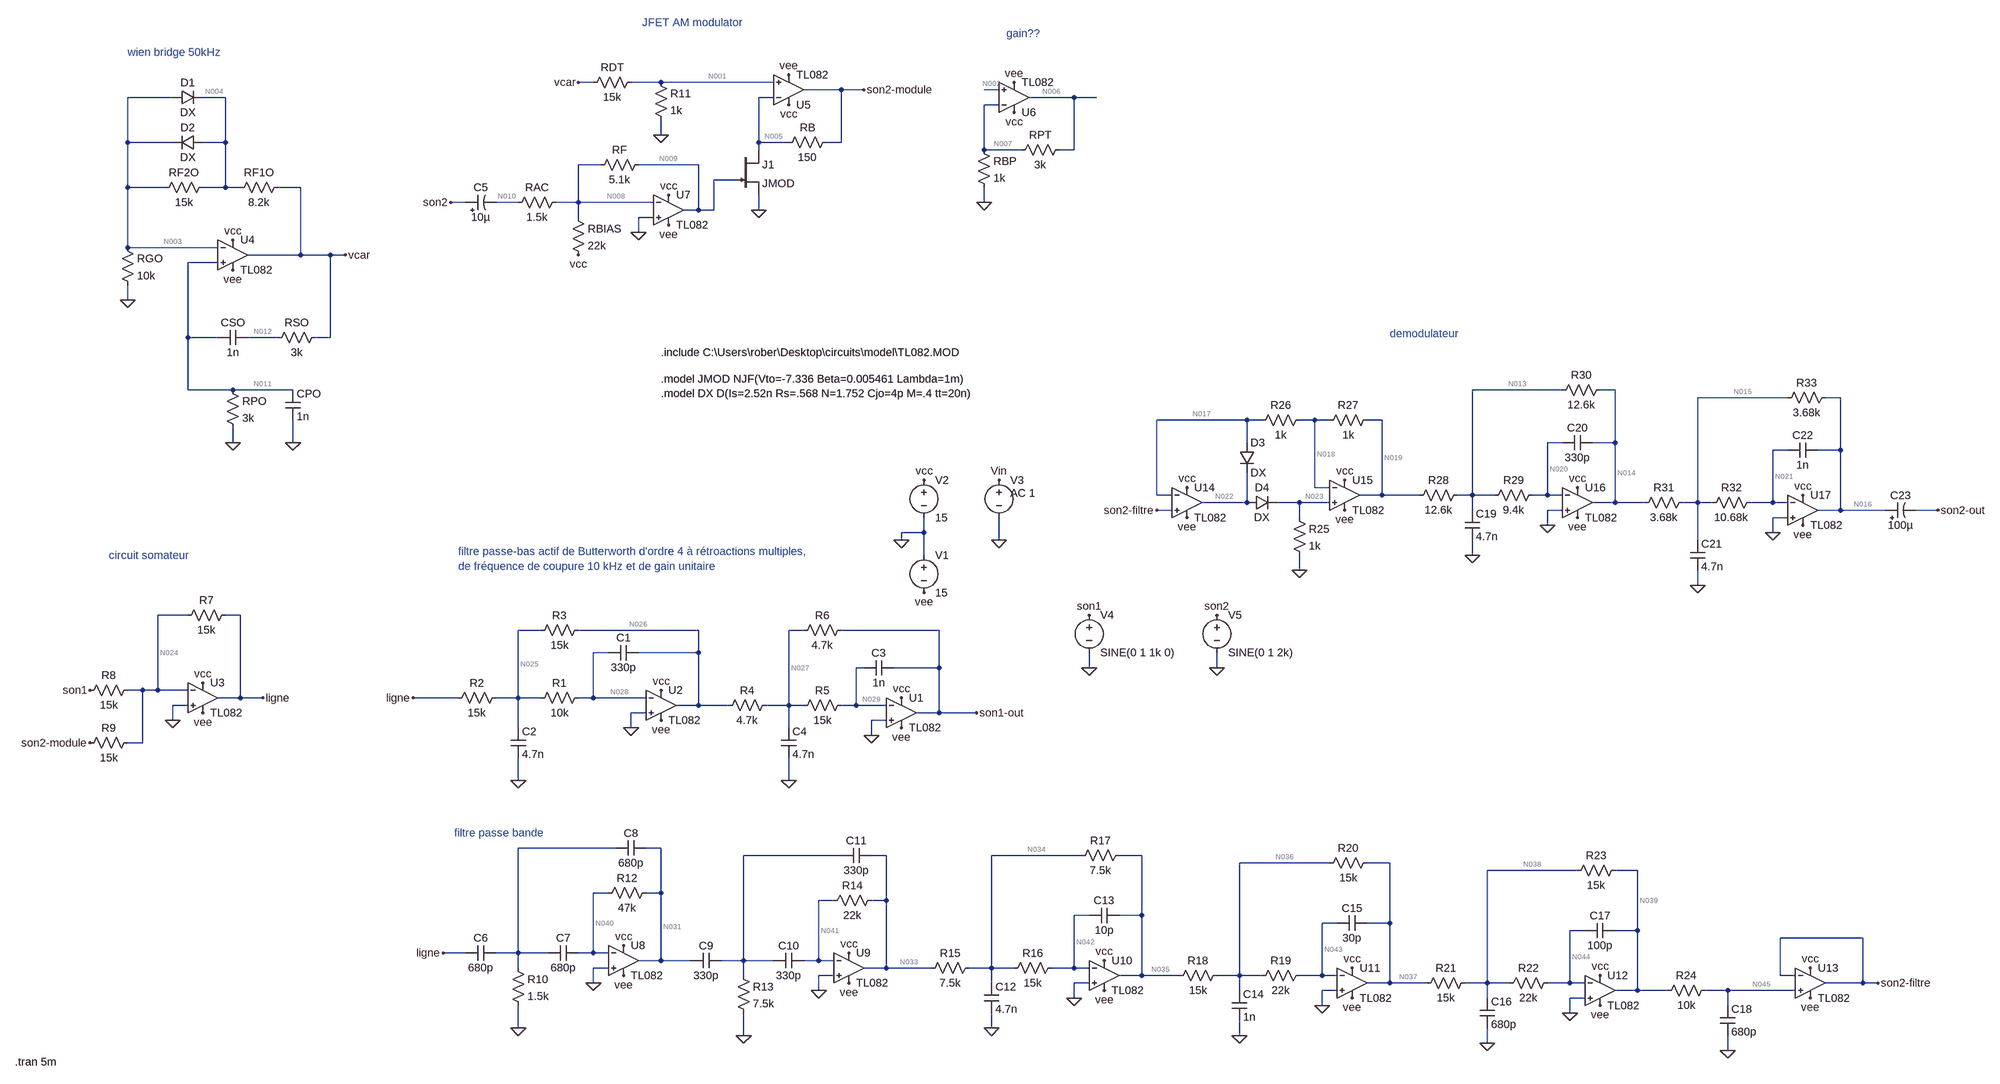
[diagram p0: schematic total.asc]
total.asc, the LTspice schematic file:
Version 4.1
SHEET 1 2896 856
WIRE -192 -1248 -224 -1248
WIRE -48 -1248 -112 -1248
WIRE 192 -1248 -48 -1248
WIRE 336 -1232 256 -1232
WIRE 384 -1232 336 -1232
WIRE 672 -1232 640 -1232
WIRE -1088 -1216 -1184 -1216
WIRE -976 -1216 -1024 -1216
WIRE 192 -1216 160 -1216
WIRE 832 -1216 736 -1216
WIRE 880 -1216 832 -1216
WIRE 672 -1200 640 -1200
WIRE -48 -1136 -48 -1168
WIRE -1184 -1120 -1184 -1216
WIRE -1088 -1120 -1184 -1120
WIRE -976 -1120 -976 -1216
WIRE -976 -1120 -1024 -1120
WIRE 160 -1120 160 -1216
WIRE 224 -1120 160 -1120
WIRE 336 -1120 336 -1232
WIRE 336 -1120 304 -1120
WIRE 160 -1104 160 -1120
WIRE 640 -1104 640 -1200
WIRE 720 -1104 640 -1104
WIRE 832 -1104 832 -1216
WIRE 832 -1104 800 -1104
WIRE -176 -1072 -224 -1072
WIRE 32 -1072 -96 -1072
WIRE 112 -1040 64 -1040
WIRE -1184 -1024 -1184 -1120
WIRE -1104 -1024 -1184 -1024
WIRE -976 -1024 -976 -1120
WIRE -976 -1024 -1024 -1024
WIRE -944 -1024 -976 -1024
WIRE -816 -1024 -864 -1024
WIRE -464 -992 -496 -992
WIRE -352 -992 -400 -992
WIRE -224 -992 -224 -1072
WIRE -224 -992 -272 -992
WIRE -64 -992 -224 -992
WIRE 640 -992 640 -1024
WIRE 32 -976 32 -1072
WIRE 32 -976 0 -976
WIRE 64 -976 64 -1040
WIRE 64 -976 32 -976
WIRE 160 -976 160 -1008
WIRE -224 -960 -224 -992
WIRE -64 -960 -96 -960
WIRE -96 -928 -96 -960
WIRE -1184 -896 -1184 -1024
WIRE -992 -896 -1184 -896
WIRE -816 -880 -816 -1024
WIRE -816 -880 -928 -880
WIRE -752 -880 -816 -880
WIRE -720 -880 -752 -880
WIRE -992 -864 -1056 -864
WIRE -1184 -784 -1184 -816
WIRE -1056 -704 -1056 -864
WIRE -992 -704 -1056 -704
WIRE -864 -704 -928 -704
WIRE -752 -704 -752 -880
WIRE -752 -704 -784 -704
WIRE -1056 -592 -1056 -704
WIRE -960 -592 -1056 -592
WIRE -832 -592 -960 -592
WIRE 1872 -592 1680 -592
WIRE 1984 -592 1952 -592
WIRE 2352 -576 2160 -576
WIRE 2464 -576 2432 -576
WIRE 1200 -528 1008 -528
WIRE 1232 -528 1200 -528
WIRE 1344 -528 1312 -528
WIRE 1376 -528 1344 -528
WIRE 1488 -528 1456 -528
WIRE -960 -480 -960 -512
WIRE -832 -480 -832 -528
WIRE 1200 -480 1200 -528
WIRE 1872 -480 1840 -480
WIRE 1984 -480 1984 -592
WIRE 1984 -480 1936 -480
WIRE 2352 -464 2320 -464
WIRE 2464 -464 2464 -576
WIRE 2464 -464 2416 -464
WIRE 1344 -384 1344 -528
WIRE 1376 -384 1344 -384
WIRE 1008 -368 1008 -528
WIRE 1040 -368 1008 -368
WIRE 1488 -368 1488 -528
WIRE 1488 -368 1440 -368
WIRE 1568 -368 1488 -368
WIRE 1680 -368 1680 -592
WIRE 1680 -368 1648 -368
WIRE 1728 -368 1680 -368
WIRE 1840 -368 1840 -480
WIRE 1840 -368 1808 -368
WIRE 1872 -368 1840 -368
WIRE 1200 -352 1200 -416
WIRE 1200 -352 1104 -352
WIRE 1312 -352 1264 -352
WIRE 1376 -352 1312 -352
WIRE 1984 -352 1984 -480
WIRE 1984 -352 1936 -352
WIRE 2048 -352 1984 -352
WIRE 2160 -352 2160 -576
WIRE 2160 -352 2128 -352
WIRE 2192 -352 2160 -352
WIRE 2320 -352 2320 -464
WIRE 2320 -352 2272 -352
WIRE 2352 -352 2320 -352
WIRE 1040 -336 1008 -336
WIRE 1680 -336 1680 -368
WIRE 1872 -336 1840 -336
WIRE 2464 -336 2464 -464
WIRE 2464 -336 2416 -336
WIRE 2560 -336 2464 -336
WIRE 2672 -336 2624 -336
WIRE 1312 -320 1312 -352
WIRE 2352 -320 2320 -320
WIRE 1840 -304 1840 -336
WIRE 512 -288 512 -320
WIRE 512 -288 464 -288
WIRE 2320 -288 2320 -320
WIRE 464 -272 464 -288
WIRE 672 -272 672 -320
WIRE 2160 -272 2160 -352
WIRE 512 -240 512 -288
WIRE 1680 -240 1680 -272
WIRE 1312 -208 1312 -240
WIRE 2160 -176 2160 -208
WIRE -1056 -112 -1120 -112
WIRE -944 -112 -976 -112
WIRE -304 -80 -352 -80
WIRE 32 -80 -224 -80
WIRE 256 -80 224 -80
WIRE 544 -80 336 -80
WIRE -160 -32 -192 -32
WIRE 32 -32 32 -80
WIRE 32 -32 -96 -32
WIRE 384 0 368 0
WIRE 544 0 544 -80
WIRE 544 0 448 0
WIRE 864 0 864 -32
WIRE 1136 0 1136 -32
WIRE -1152 48 -1184 48
WIRE -1120 48 -1120 -112
WIRE -1120 48 -1152 48
WIRE -1056 48 -1120 48
WIRE -944 64 -944 -112
WIRE -944 64 -992 64
WIRE -896 64 -944 64
WIRE -480 64 -576 64
WIRE -352 64 -352 -80
WIRE -352 64 -400 64
WIRE -304 64 -352 64
WIRE -192 64 -192 -32
WIRE -192 64 -224 64
WIRE -80 64 -192 64
WIRE -1056 80 -1088 80
WIRE 32 80 32 -32
WIRE 32 80 -16 80
WIRE 96 80 32 80
WIRE 224 80 224 -80
WIRE 224 80 176 80
WIRE 256 80 224 80
WIRE 368 80 368 0
WIRE 368 80 336 80
WIRE 432 80 368 80
WIRE -80 96 -112 96
WIRE 544 96 544 0
WIRE 544 96 496 96
WIRE 624 96 544 96
WIRE -1088 112 -1088 80
WIRE 432 112 400 112
WIRE -352 128 -352 64
WIRE -112 128 -112 96
WIRE 224 128 224 80
WIRE 400 144 400 112
WIRE -1152 160 -1152 48
WIRE -1152 160 -1184 160
WIRE -352 240 -352 192
WIRE 224 240 224 192
WIRE -144 384 -352 384
WIRE -48 384 -80 384
WIRE 336 400 128 400
WIRE 432 400 400 400
WIRE 848 400 656 400
WIRE 976 400 928 400
WIRE 1376 416 1184 416
WIRE 1504 416 1456 416
WIRE 1904 432 1712 432
WIRE 2032 432 1984 432
WIRE -160 480 -192 480
WIRE -48 480 -48 384
WIRE -48 480 -80 480
WIRE 320 496 288 496
WIRE 432 496 432 400
WIRE 432 496 400 496
WIRE 864 528 832 528
WIRE 976 528 976 400
WIRE 976 528 928 528
WIRE 1392 544 1360 544
WIRE 1504 544 1504 416
WIRE 1504 544 1456 544
WIRE 1920 560 1888 560
WIRE 2032 560 2032 432
WIRE 2032 560 1984 560
WIRE 2512 576 2336 576
WIRE -464 608 -512 608
WIRE -352 608 -352 384
WIRE -352 608 -400 608
WIRE -288 608 -352 608
WIRE -192 608 -192 480
WIRE -192 608 -224 608
WIRE -160 608 -192 608
WIRE -48 624 -48 480
WIRE -48 624 -96 624
WIRE 16 624 -48 624
WIRE 128 624 128 400
WIRE 128 624 80 624
WIRE 192 624 128 624
WIRE 288 624 288 496
WIRE 288 624 256 624
WIRE 320 624 288 624
WIRE -352 640 -352 608
WIRE -160 640 -192 640
WIRE 432 640 432 496
WIRE 432 640 384 640
WIRE 528 640 432 640
WIRE 656 640 656 400
WIRE 656 640 608 640
WIRE 704 640 656 640
WIRE 832 640 832 528
WIRE 832 640 784 640
WIRE 864 640 832 640
WIRE 128 656 128 624
WIRE 320 656 288 656
WIRE 976 656 976 528
WIRE 976 656 928 656
WIRE 1056 656 976 656
WIRE 1184 656 1184 416
WIRE 1184 656 1136 656
WIRE 1232 656 1184 656
WIRE 1360 656 1360 544
WIRE 1360 656 1312 656
WIRE 1392 656 1360 656
WIRE 2336 656 2336 576
WIRE 2368 656 2336 656
WIRE -192 672 -192 640
WIRE 656 672 656 640
WIRE 864 672 832 672
WIRE 1504 672 1504 544
WIRE 1504 672 1456 672
WIRE 1584 672 1504 672
WIRE 1712 672 1712 432
WIRE 1712 672 1664 672
WIRE 1760 672 1712 672
WIRE 1888 672 1888 560
WIRE 1888 672 1840 672
WIRE 1920 672 1888 672
WIRE 2512 672 2512 576
WIRE 2512 672 2432 672
WIRE 2544 672 2512 672
WIRE 288 688 288 656
WIRE 1184 688 1184 656
WIRE 1392 688 1360 688
WIRE 2032 688 2032 560
WIRE 2032 688 1984 688
WIRE 2096 688 2032 688
WIRE 2224 688 2176 688
WIRE 2368 688 2224 688
WIRE 832 704 832 672
WIRE 1712 704 1712 672
WIRE 1920 704 1888 704
WIRE 1360 720 1360 688
WIRE 2224 720 2224 688
WIRE 1888 736 1888 704
WIRE -352 768 -352 720
WIRE 656 768 656 736
WIRE 128 784 128 736
WIRE 1184 784 1184 752
WIRE 1712 800 1712 768
WIRE 2224 816 2224 784
FLAG 464 -272 0
FLAG 512 -400 vcc
FLAG 464 64 vcc
FLAG 512 -160 vee
FLAG 464 128 vee
FLAG -48 48 vcc
FLAG -48 112 vee
FLAG -112 128 0
FLAG 400 144 0
FLAG -352 240 0
FLAG 224 240 0
FLAG 672 -272 0
FLAG 672 -400 Vin
FLAG -1024 32 vcc
FLAG -1024 96 vee
FLAG -1088 112 0
FLAG -1264 48 son1
FLAG -1264 160 son2-module
FLAG -896 64 ligne
FLAG -576 64 ligne
FLAG -960 -912 vcc
FLAG -960 -848 vee
FLAG -1184 -784 0
FLAG -960 -480 0
FLAG -832 -480 0
FLAG -720 -880 vcar
FLAG -48 -1136 0
FLAG 224 -1200 vcc
FLAG 224 -1264 vee
FLAG 704 -1184 vcc
FLAG 704 -1248 vee
FLAG -32 -1008 vcc
FLAG -32 -944 vee
FLAG 160 -976 0
FLAG -224 -1248 vcar
FLAG 640 -992 0
FLAG 384 -1232 son2-module
FLAG -96 -928 0
FLAG -224 -880 vcc
FLAG -496 -992 son2
FLAG -512 608 ligne
FLAG -352 768 0
FLAG -128 592 vcc
FLAG -128 656 vee
FLAG -192 672 0
FLAG 128 784 0
FLAG 352 608 vcc
FLAG 352 672 vee
FLAG 288 688 0
FLAG 656 768 0
FLAG 896 624 vcc
FLAG 896 688 vee
FLAG 832 704 0
FLAG 1184 784 0
FLAG 1424 640 vcc
FLAG 1424 704 vee
FLAG 1360 720 0
FLAG 1712 800 0
FLAG 1952 656 vcc
FLAG 1952 720 vee
FLAG 1888 736 0
FLAG 2224 816 0
FLAG 2400 640 vcc
FLAG 2400 704 vee
FLAG 1072 -384 vcc
FLAG 1072 -320 vee
FLAG 1408 -400 vcc
FLAG 1408 -336 vee
FLAG 1904 -384 vcc
FLAG 1904 -320 vee
FLAG 1312 -208 0
FLAG 1680 -240 0
FLAG 1840 -304 0
FLAG 2384 -368 vcc
FLAG 2384 -304 vee
FLAG 2160 -176 0
FLAG 2320 -288 0
FLAG 624 96 son1-out
FLAG 2544 672 son2-filtre
FLAG 1008 -336 son2-filtre
FLAG 2672 -336 son2-out
FLAG 864 0 0
FLAG 1136 0 0
FLAG 864 -112 son1
FLAG 1136 -112 son2
SYMBOL OpAmps\\opamp2 464 32 R0
SYMATTR InstName U1
SYMATTR Value TL082
SYMBOL voltage 512 -256 R0
WINDOW 123 0 0 Left 0
WINDOW 39 0 0 Left 0
SYMATTR InstName V1
SYMATTR Value 15
SYMBOL voltage 512 -416 R0
WINDOW 123 0 0 Left 0
WINDOW 39 0 0 Left 0
SYMATTR InstName V2
SYMATTR Value 15
SYMBOL OpAmps\\opamp2 -48 16 R0
SYMATTR InstName U2
SYMATTR Value TL082
SYMBOL res -208 48 R90
WINDOW 0 0 56 VBottom 2
WINDOW 3 32 56 VTop 2
SYMATTR InstName R1
SYMATTR Value 10k
SYMBOL res -384 48 R90
WINDOW 0 0 56 VBottom 2
WINDOW 3 32 56 VTop 2
SYMATTR InstName R2
SYMATTR Value 15k
SYMBOL res -208 -96 R90
WINDOW 0 0 56 VBottom 2
WINDOW 3 32 56 VTop 2
SYMATTR InstName R3
SYMATTR Value 15k
SYMBOL cap -96 -48 R90
WINDOW 0 0 32 VBottom 2
WINDOW 3 32 32 VTop 2
SYMATTR InstName C1
SYMATTR Value 330p
SYMBOL cap -368 128 R0
SYMATTR InstName C2
SYMATTR Value 4.7n
SYMBOL res 192 64 R90
WINDOW 0 0 56 VBottom 2
WINDOW 3 32 56 VTop 2
SYMATTR InstName R4
SYMATTR Value 4.7k
SYMBOL res 352 64 R90
WINDOW 0 0 56 VBottom 2
WINDOW 3 32 56 VTop 2
SYMATTR InstName R5
SYMATTR Value 15k
SYMBOL res 352 -96 R90
WINDOW 0 0 56 VBottom 2
WINDOW 3 32 56 VTop 2
SYMATTR InstName R6
SYMATTR Value 4.7k
SYMBOL cap 448 -16 R90
WINDOW 0 0 32 VBottom 2
WINDOW 3 32 32 VTop 2
SYMATTR InstName C3
SYMATTR Value 1n
SYMBOL cap 208 128 R0
SYMATTR InstName C4
SYMATTR Value 4.7n
SYMBOL voltage 672 -416 R0
WINDOW 123 24 44 Left 2
WINDOW 39 0 0 Left 0
SYMATTR Value2 AC 1
SYMATTR InstName V3
SYMATTR Value ""
SYMBOL OpAmps\\opamp2 -1024 0 R0
SYMATTR InstName U3
SYMATTR Value TL082
SYMBOL res -960 -128 R90
WINDOW 0 0 56 VBottom 2
WINDOW 3 32 56 VTop 2
SYMATTR InstName R7
SYMATTR Value 15k
SYMBOL res -1168 32 R90
WINDOW 0 0 56 VBottom 2
WINDOW 3 32 56 VTop 2
SYMATTR InstName R8
SYMATTR Value 15k
SYMBOL res -1168 144 R90
WINDOW 0 0 56 VBottom 2
WINDOW 3 32 56 VTop 2
SYMATTR InstName R9
SYMATTR Value 15k
SYMBOL diode -1088 -1200 R270
WINDOW 0 32 32 VTop 2
WINDOW 3 0 32 VBottom 2
SYMATTR InstName D1
SYMATTR Value DX
SYMBOL diode -1024 -1136 R90
WINDOW 0 0 32 VBottom 2
WINDOW 3 32 32 VTop 2
SYMATTR InstName D2
SYMATTR Value DX
SYMBOL res -1008 -1040 R90
WINDOW 0 0 56 VBottom 2
WINDOW 3 32 56 VTop 2
SYMATTR InstName RF2O
SYMATTR Value 15k
SYMBOL res -848 -1040 R90
WINDOW 0 0 56 VBottom 2
WINDOW 3 32 56 VTop 2
SYMATTR InstName RF1O
SYMATTR Value 8.2k
SYMBOL OpAmps\\opamp2 -960 -944 R0
SYMATTR InstName U4
SYMATTR Value TL082
SYMBOL res -1200 -912 R0
SYMATTR InstName RGO
SYMATTR Value 10k
SYMBOL cap -928 -720 R90
WINDOW 0 0 32 VBottom 2
WINDOW 3 32 32 VTop 2
SYMATTR InstName CSO
SYMATTR Value 1n
SYMBOL res -768 -720 R90
WINDOW 0 0 56 VBottom 2
WINDOW 3 32 56 VTop 2
SYMATTR InstName RSO
SYMATTR Value 3k
SYMBOL res -976 -608 R0
SYMATTR InstName RPO
SYMATTR Value 3k
SYMBOL cap -848 -592 R0
SYMATTR InstName CPO
SYMATTR Value 1n
SYMBOL res -96 -1264 R90
WINDOW 0 0 56 VBottom 2
WINDOW 3 32 56 VTop 2
SYMATTR InstName RDT
SYMATTR Value 15k
SYMBOL res -64 -1264 R0
SYMATTR InstName R11
SYMATTR Value 1k
SYMBOL OpAmps\\opamp2 224 -1168 M180
SYMATTR InstName U5
SYMATTR Value TL082
SYMBOL OpAmps\\opamp2 704 -1152 M180
SYMATTR InstName U6
SYMATTR Value TL082
SYMBOL OpAmps\\opamp2 -32 -1040 R0
SYMATTR InstName U7
SYMATTR Value TL082
SYMBOL njf 112 -1104 R0
SYMATTR InstName J1
SYMATTR Value JMOD
SYMBOL res 320 -1136 R90
WINDOW 0 0 56 VBottom 2
WINDOW 3 32 56 VTop 2
SYMATTR InstName RB
SYMATTR Value 150
SYMBOL res 816 -1120 R90
WINDOW 0 0 56 VBottom 2
WINDOW 3 32 56 VTop 2
SYMATTR InstName RPT
SYMATTR Value 3k
SYMBOL res 624 -1120 R0
SYMATTR InstName RBP
SYMATTR Value 1k
SYMBOL res -240 -976 R0
SYMATTR InstName RBIAS
SYMATTR Value 22k
SYMBOL res -80 -1088 R90
WINDOW 0 0 56 VBottom 2
WINDOW 3 32 56 VTop 2
SYMATTR InstName RF
SYMATTR Value 5.1k
SYMBOL res -256 -1008 R90
WINDOW 0 0 56 VBottom 2
WINDOW 3 32 56 VTop 2
SYMATTR InstName RAC
SYMATTR Value 1.5k
SYMBOL polcap -464 -976 R270
WINDOW 0 32 32 VTop 2
WINDOW 3 0 32 VBottom 2
SYMATTR InstName C5
SYMATTR Value 10µ
SYMBOL cap -400 592 R90
WINDOW 0 0 32 VBottom 2
WINDOW 3 32 32 VTop 2
SYMATTR InstName C6
SYMATTR Value 680p
SYMBOL res -368 624 R0
SYMATTR InstName R10
SYMATTR Value 1.5k
SYMBOL cap -224 592 R90
WINDOW 0 0 32 VBottom 2
WINDOW 3 32 32 VTop 2
SYMATTR InstName C7
SYMATTR Value 680p
SYMBOL OpAmps\\opamp2 -128 560 R0
SYMATTR InstName U8
SYMATTR Value TL082
SYMBOL res -64 464 R90
WINDOW 0 0 56 VBottom 2
WINDOW 3 32 56 VTop 2
SYMATTR InstName R12
SYMATTR Value 47k
SYMBOL cap -80 368 R90
WINDOW 0 0 32 VBottom 2
WINDOW 3 32 32 VTop 2
SYMATTR InstName C8
SYMATTR Value 680p
SYMBOL cap 80 608 R90
WINDOW 0 0 32 VBottom 2
WINDOW 3 32 32 VTop 2
SYMATTR InstName C9
SYMATTR Value 330p
SYMBOL res 112 640 R0
SYMATTR InstName R13
SYMATTR Value 7.5k
SYMBOL cap 256 608 R90
WINDOW 0 0 32 VBottom 2
WINDOW 3 32 32 VTop 2
SYMATTR InstName C10
SYMATTR Value 330p
SYMBOL OpAmps\\opamp2 352 576 R0
SYMATTR InstName U9
SYMATTR Value TL082
SYMBOL res 416 480 R90
WINDOW 0 0 56 VBottom 2
WINDOW 3 32 56 VTop 2
SYMATTR InstName R14
SYMATTR Value 22k
SYMBOL cap 400 384 R90
WINDOW 0 0 32 VBottom 2
WINDOW 3 32 32 VTop 2
SYMATTR InstName C11
SYMATTR Value 330p
SYMBOL res 624 624 R90
WINDOW 0 0 56 VBottom 2
WINDOW 3 32 56 VTop 2
SYMATTR InstName R15
SYMATTR Value 7.5k
SYMBOL res 800 624 R90
WINDOW 0 0 56 VBottom 2
WINDOW 3 32 56 VTop 2
SYMATTR InstName R16
SYMATTR Value 15k
SYMBOL cap 640 672 R0
SYMATTR InstName C12
SYMATTR Value 4.7n
SYMBOL OpAmps\\opamp2 896 592 R0
SYMATTR InstName U10
SYMATTR Value TL082
SYMBOL cap 928 512 R90
WINDOW 0 0 32 VBottom 2
WINDOW 3 32 32 VTop 2
SYMATTR InstName C13
SYMATTR Value 10p
SYMBOL res 944 384 R90
WINDOW 0 0 56 VBottom 2
WINDOW 3 32 56 VTop 2
SYMATTR InstName R17
SYMATTR Value 7.5k
SYMBOL res 1152 640 R90
WINDOW 0 0 56 VBottom 2
WINDOW 3 32 56 VTop 2
SYMATTR InstName R18
SYMATTR Value 15k
SYMBOL res 1328 640 R90
WINDOW 0 0 56 VBottom 2
WINDOW 3 32 56 VTop 2
SYMATTR InstName R19
SYMATTR Value 22k
SYMBOL cap 1168 688 R0
SYMATTR InstName C14
SYMATTR Value 1n
SYMBOL OpAmps\\opamp2 1424 608 R0
SYMATTR InstName U11
SYMATTR Value TL082
SYMBOL cap 1456 528 R90
WINDOW 0 0 32 VBottom 2
WINDOW 3 32 32 VTop 2
SYMATTR InstName C15
SYMATTR Value 30p
SYMBOL res 1472 400 R90
WINDOW 0 0 56 VBottom 2
WINDOW 3 32 56 VTop 2
SYMATTR InstName R20
SYMATTR Value 15k
SYMBOL res 1680 656 R90
WINDOW 0 0 56 VBottom 2
WINDOW 3 32 56 VTop 2
SYMATTR InstName R21
SYMATTR Value 15k
SYMBOL res 1856 656 R90
WINDOW 0 0 56 VBottom 2
WINDOW 3 32 56 VTop 2
SYMATTR InstName R22
SYMATTR Value 22k
SYMBOL cap 1696 704 R0
SYMATTR InstName C16
SYMATTR Value 680p
SYMBOL OpAmps\\opamp2 1952 624 R0
SYMATTR InstName U12
SYMATTR Value TL082
SYMBOL cap 1984 544 R90
WINDOW 0 0 32 VBottom 2
WINDOW 3 32 32 VTop 2
SYMATTR InstName C17
SYMATTR Value 100p
SYMBOL res 2000 416 R90
WINDOW 0 0 56 VBottom 2
WINDOW 3 32 56 VTop 2
SYMATTR InstName R23
SYMATTR Value 15k
SYMBOL res 2192 672 R90
WINDOW 0 0 56 VBottom 2
WINDOW 3 32 56 VTop 2
SYMATTR InstName R24
SYMATTR Value 10k
SYMBOL cap 2208 720 R0
SYMATTR InstName C18
SYMATTR Value 680p
SYMBOL OpAmps\\opamp2 2400 608 R0
SYMATTR InstName U13
SYMATTR Value TL082
SYMBOL OpAmps\\opamp2 1072 -416 R0
SYMATTR InstName U14
SYMATTR Value TL082
SYMBOL OpAmps\\opamp2 1408 -432 R0
SYMATTR InstName U15
SYMATTR Value TL082
SYMBOL OpAmps\\opamp2 1904 -416 R0
SYMATTR InstName U16
SYMATTR Value TL082
SYMBOL diode 1184 -480 R0
SYMATTR InstName D3
SYMATTR Value DX
SYMBOL diode 1200 -336 R270
WINDOW 0 32 32 VTop 2
WINDOW 3 0 32 VBottom 2
SYMATTR InstName D4
SYMATTR Value DX
SYMBOL res 1296 -336 R0
SYMATTR InstName R25
SYMATTR Value 1k
SYMBOL res 1328 -544 R90
WINDOW 0 0 56 VBottom 2
WINDOW 3 32 56 VTop 2
SYMATTR InstName R26
SYMATTR Value 1k
SYMBOL res 1472 -544 R90
WINDOW 0 0 56 VBottom 2
WINDOW 3 32 56 VTop 2
SYMATTR InstName R27
SYMATTR Value 1k
SYMBOL res 1664 -384 R90
WINDOW 0 0 56 VBottom 2
WINDOW 3 32 56 VTop 2
SYMATTR InstName R28
SYMATTR Value 12.6k
SYMBOL cap 1664 -336 R0
SYMATTR InstName C19
SYMATTR Value 4.7n
SYMBOL res 1824 -384 R90
WINDOW 0 0 56 VBottom 2
WINDOW 3 32 56 VTop 2
SYMATTR InstName R29
SYMATTR Value 9.4k
SYMBOL cap 1936 -496 R90
WINDOW 0 0 32 VBottom 2
WINDOW 3 32 32 VTop 2
SYMATTR InstName C20
SYMATTR Value 330p
SYMBOL res 1968 -608 R90
WINDOW 0 0 56 VBottom 2
WINDOW 3 32 56 VTop 2
SYMATTR InstName R30
SYMATTR Value 12.6k
SYMBOL OpAmps\\opamp2 2384 -400 R0
SYMATTR InstName U17
SYMATTR Value TL082
SYMBOL res 2144 -368 R90
WINDOW 0 0 56 VBottom 2
WINDOW 3 32 56 VTop 2
SYMATTR InstName R31
SYMATTR Value 3.68k
SYMBOL cap 2144 -272 R0
SYMATTR InstName C21
SYMATTR Value 4.7n
SYMBOL res 2288 -368 R90
WINDOW 0 0 56 VBottom 2
WINDOW 3 32 56 VTop 2
SYMATTR InstName R32
SYMATTR Value 10.68k
SYMBOL cap 2416 -480 R90
WINDOW 0 0 32 VBottom 2
WINDOW 3 32 32 VTop 2
SYMATTR InstName C22
SYMATTR Value 1n
SYMBOL res 2448 -592 R90
WINDOW 0 0 56 VBottom 2
WINDOW 3 32 56 VTop 2
SYMATTR InstName R33
SYMATTR Value 3.68k
SYMBOL polcap 2560 -320 R270
WINDOW 0 32 32 VTop 2
WINDOW 3 0 32 VBottom 2
SYMATTR InstName C23
SYMATTR Value 100µ
SYMBOL voltage 864 -128 R0
WINDOW 123 0 0 Left 0
WINDOW 39 0 0 Left 0
SYMATTR InstName V4
SYMATTR Value SINE(0 1 1k 0)
SYMBOL voltage 1136 -128 R0
WINDOW 123 0 0 Left 0
WINDOW 39 0 0 Left 0
SYMATTR InstName V5
SYMATTR Value SINE(0 1 2k)
TEXT -48 -672 Left 2 !.include C:\\Users\\rober\\Desktop\\circuits\\model\\TL082.MOD
TEXT -480 -248 Left 2 ;filtre passe-bas actif de Butterworth d'ordre 4 à rétroactions multiples, \nde fréquence de coupure 10 kHz et de gain unitaire
TEXT -1224 -240 Left 2 ;circuit somateur
TEXT -48 -616 Left 2 !.model JMOD NJF(Vto=-7.336 Beta=0.005461 Lambda=1m)\n.model DX D(Is=2.52n Rs=.568 N=1.752 Cjo=4p M=.4 tt=20n)
TEXT -1184 -1312 Left 2 ;wien bridge 50kHz
TEXT -88 -1376 Left 2 ;JFET AM modulator
TEXT 688 -1352 Left 2 ;gain??
TEXT 1504 -712 Left 2 ;demodulateur
TEXT -488 352 Left 2 ;filtre passe bande
TEXT -1424 840 Left 2 !.tran 5m

The netlist it stands for:
* total.asc
X§U1 0 N029 vcc vee son1-out TL082  ; pins In+ In- V+ V- OUT
V1 0 vee 15
V2 vcc 0 15
X§U2 0 N028 vcc vee N026 TL082  ; pins In+ In- V+ V- OUT
R1 N028 N025 10k
R2 N025 ligne 15k
R3 N026 N025 15k
C1 N026 N028 330p
C2 N025 0 4.7n
R4 N027 N026 4.7k
R5 N029 N027 15k
R6 son1-out N027 4.7k
C3 son1-out N029 1n
C4 N027 0 4.7n
V3 Vin 0 AC 1
X§U3 0 N024 vcc vee ligne TL082  ; pins In+ In- V+ V- OUT
R7 ligne N024 15k
R8 N024 son1 15k
R9 N024 son2-module 15k
D1 N003 N004 DX
D2 N004 N003 DX
RF2O N004 N003 15k
RF1O vcar N004 8.2k
X§U4 N011 N003 vcc vee vcar TL082  ; pins In+ In- V+ V- OUT
RGO N003 0 10k
CSO N012 N011 1n
RSO vcar N012 3k
RPO N011 0 3k
CPO N011 0 1n
RDT N001 vcar 15k
R11 N001 0 1k
X§U5 N001 N005 vcc vee son2-module TL082  ; pins In+ In- V+ V- OUT
X§U6 N002 N007 vcc vee N006 TL082  ; pins In+ In- V+ V- OUT
X§U7 0 N008 vcc vee N009 TL082  ; pins In+ In- V+ V- OUT
J1 N005 N009 0 JMOD
RB son2-module N005 150
RPT N006 N007 3k
RBP N007 0 1k
RBIAS N008 vcc 22k
RF N009 N008 5.1k
RAC N008 N010 1.5k
C5 son2 N010 10µ
C6 N030 ligne 680p
R10 N030 0 1.5k
C7 N040 N030 680p
X§U8 0 N040 vcc vee N031 TL082  ; pins In+ In- V+ V- OUT
R12 N031 N040 47k
C8 N031 N030 680p
C9 N032 N031 330p
R13 N032 0 7.5k
C10 N041 N032 330p
X§U9 0 N041 vcc vee N033 TL082  ; pins In+ In- V+ V- OUT
R14 N033 N041 22k
C11 N033 N032 330p
R15 N034 N033 7.5k
R16 N042 N034 15k
C12 N034 0 4.7n
X§U10 0 N042 vcc vee N035 TL082  ; pins In+ In- V+ V- OUT
C13 N035 N042 10p
R17 N035 N034 7.5k
R18 N036 N035 15k
R19 N043 N036 22k
C14 N036 0 1n
X§U11 0 N043 vcc vee N037 TL082  ; pins In+ In- V+ V- OUT
C15 N037 N043 30p
R20 N037 N036 15k
R21 N038 N037 15k
R22 N044 N038 22k
C16 N038 0 680p
X§U12 0 N044 vcc vee N039 TL082  ; pins In+ In- V+ V- OUT
C17 N039 N044 100p
R23 N039 N038 15k
R24 N045 N039 10k
C18 N045 0 680p
X§U13 N045 son2-filtre vcc vee son2-filtre TL082  ; pins In+ In- V+ V- OUT
X§U14 son2-filtre N017 vcc vee N022 TL082  ; pins In+ In- V+ V- OUT
X§U15 N023 N018 vcc vee N019 TL082  ; pins In+ In- V+ V- OUT
X§U16 0 N020 vcc vee N014 TL082  ; pins In+ In- V+ V- OUT
D3 N017 N022 DX
D4 N022 N023 DX
R25 N023 0 1k
R26 N018 N017 1k
R27 N019 N018 1k
R28 N013 N019 12.6k
C19 N013 0 4.7n
R29 N020 N013 9.4k
C20 N014 N020 330p
R30 N014 N013 12.6k
X§U17 0 N021 vcc vee N016 TL082  ; pins In+ In- V+ V- OUT
R31 N015 N014 3.68k
C21 N015 0 4.7n
R32 N021 N015 10.68k
C22 N016 N021 1n
R33 N016 N015 3.68k
C23 N016 son2-out 100µ
V4 son1 0 SINE(0 1 1k 0)
V5 son2 0 SINE(0 1 2k)
.model D D
.lib standard.dio
.model NJF NJF
.model PJF PJF
.lib standard.jft
.include C:\Users\rober\Desktop\circuits\model\TL082.MOD
* filtre passe-bas actif de Butterworth d'ordre 4 à rétroactions multiples,
* de fréquence de coupure 10 kHz et de gain unitaire
* circuit somateur
.model JMOD NJF(Vto=-7.336 Beta=0.005461 Lambda=1m)
.model DX D(Is=2.52n Rs=.568 N=1.752 Cjo=4p M=.4 tt=20n)
* wien bridge 50kHz
* JFET AM modulator
* gain??
* demodulateur
* filtre passe bande
.tran 5m
.backanno
.end

* Results of the author's LTspice run, read from the files saved beside the schematic
* Operating Point, zero values left out:
*   V(ligne) = -63.35 µV
*   V(n001) = 2.27 µV
*   V(n002) = -13.75 V
*   V(n003) = 10.84 µV
*   V(n004) = 27.74 µV
*   V(n005) = 13.24 µV
*   V(n006) = -13.48 V
*   V(n007) = -3.37 V
*   V(n008) = 27.02 µV
*   V(n009) = -3.477 V
*   V(n010) = 27.02 µV
*   V(n011) = -135.2 nV
*   V(n012) = 36.99 µV
*   V(n013) = 11.39 µV
*   V(n014) = -5.042 µV
*   V(n015) = 11.45 µV
*   V(n016) = 28.11 µV
*   V(n017) = 32.73 µV
*   V(n018) = 30.54 µV
*   V(n019) = 28.4 µV
*   V(n020) = 10.97 µV
*   V(n021) = 10.97 µV
*   V(n022) = 98.49 mV
*   V(n023) = 19.57 µV
*   V(n024) = 10.97 µV
*   V(n025) = 11.42 µV
*   V(n026) = 86.87 µV
*   V(n027) = 11.65 µV
*   V(n028) = 10.97 µV
*   V(n029) = 10.97 µV
*   V(n031) = 13.09 µV
*   V(n033) = 11.96 µV
*   V(n034) = 11.65 µV
*   V(n035) = 11.67 µV
*   V(n036) = 11.96 µV
*   V(n037) = 12.93 µV
*   V(n038) = 11.96 µV
*   V(n039) = 11.67 µV
*   V(n040) = 10.97 µV
*   V(n041) = 10.97 µV
*   V(n042) = 10.97 µV
*   V(n043) = 10.97 µV
*   V(n044) = 10.97 µV
*   V(n045) = 11.22 µV
*   V(son1-out) = -63.36 µV
*   V(son2-filtre) = 22.19 µV
*   V(son2-module) = 96.94 µV
*   V(son2-out) = 28.11 µV
*   V(vcar) = 36.99 µV
*   V(vcc) = 15 V
*   V(vee) = -15 V
*   I(D3) = -2.233 nA
*   I(D4) = 19.62 nA
*   I(R1) = -45.05 pA
*   I(R11) = 2.27 nA
*   I(R12) = 45.05 pA
*   I(R14) = 45.05 pA
*   I(R15) = -42.05 pA
*   I(R16) = -45.05 pA
*   I(R17) = 3.004 pA
*   I(R18) = 19.52 pA
*   I(R19) = -45.05 pA
*   I(R2) = 4.985 nA
*   I(R20) = 64.58 pA
*   I(R21) = -64.58 pA
*   I(R22) = -45.05 pA
*   I(R23) = -19.52 pA
*   I(R24) = -45.05 pA
*   I(R25) = 19.57 nA
*   I(R26) = -2.188 nA
*   I(R27) = -2.143 nA
*   I(R28) = -1.35 nA
*   I(R29) = -45.05 pA
*   I(R3) = 5.03 nA
*   I(R30) = -1.304 nA
*   I(R31) = 4.482 nA
*   I(R32) = -45.05 pA
*   I(R33) = 4.527 nA
*   I(R4) = -16 nA
*   I(R5) = -45.05 pA
*   I(R6) = -15.96 nA
*   I(R7) = -4.955 nA
*   I(R8) = 731.4 pA
*   I(R9) = -5.731 nA
*   I(RB) = 558 nA
*   I(RBIAS) = -681.8 µA
*   I(RBP) = -3.37 mA
*   I(RDT) = -2.315 nA
*   I(RF) = -681.8 µA
*   I(RF1O) = 1.129 nA
*   I(RF2O) = 1.127 nA
*   I(RGO) = 1.084 nA
*   I(RPO) = -45.05 pA
*   I(RPT) = -3.37 mA
*   I(V1) = -241.1 mA
*   I(V2) = -242 mA
*   I(V4) = 731.4 pA
*   Id(J1) = 558 nA
*   Ig(J1) = -6.974 pA
*   Is(J1) = -558 nA